# EAGLE design Programmer v1.0 (EAGLE 7.6.0)
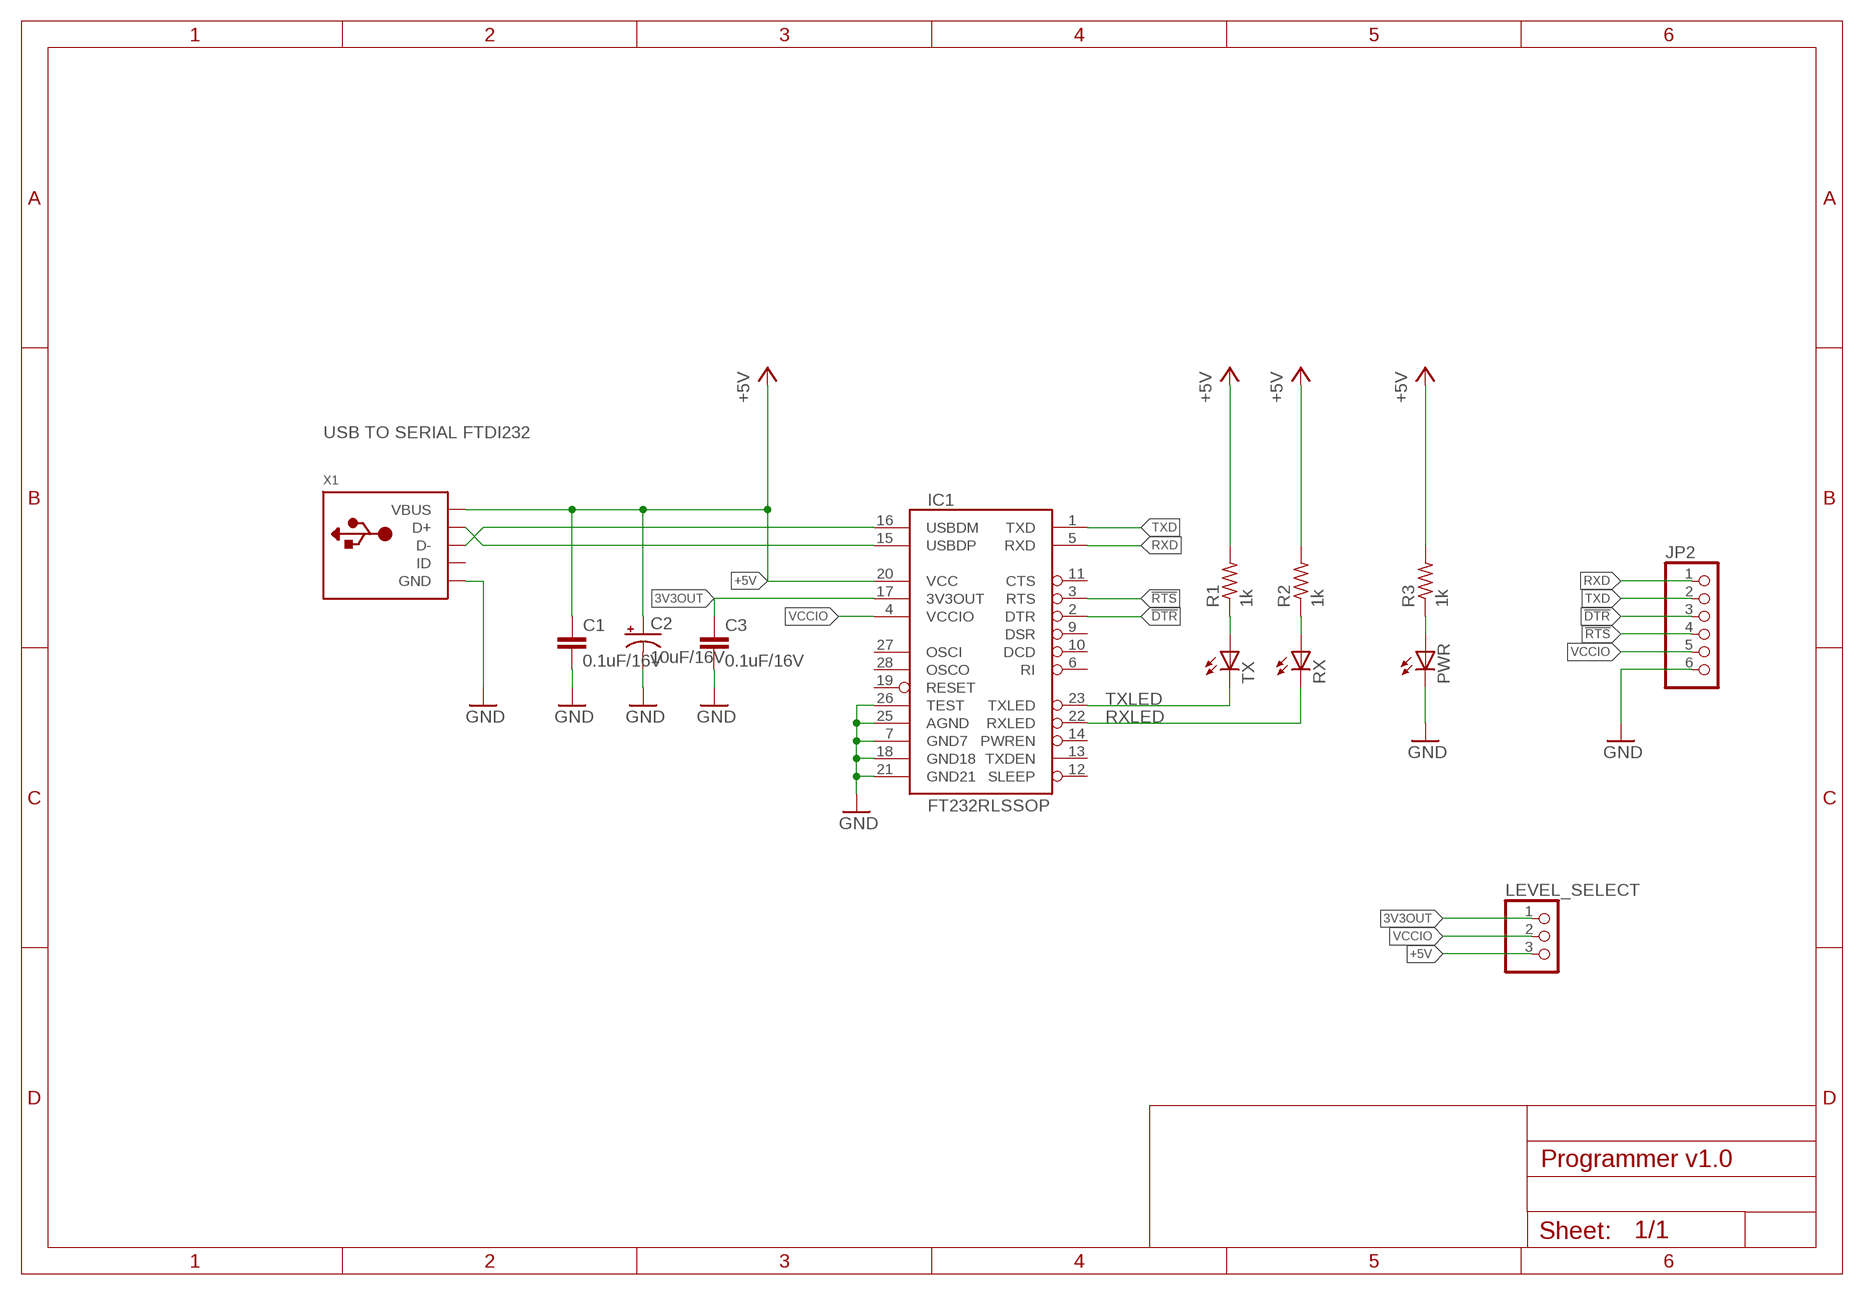
[diagram p0: schematic, sheet 1]

## Parts
C1  0.1uF/16V  C-EUC0805K  [C0805K]
C2  10uF/16V  SPARKFUN_CAP_POL1206  [SPARKFUN_EIA3216]
C3  0.1uF/16V  C-EUC0805K  [C0805K]
IC1  FT232RLSSOP  [SSOP28DB]
JP2  PINHD-1X6  [1X06]
LEVEL_SELECT  PINHD-1X3  [1X03]
PWR  LEDCHIP-LED0805  [CHIP-LED0805]
R1  1k  R-US_M0805  [M0805]
R2  1k  R-US_M0805  [M0805]
R3  1k  R-US_M0805  [M0805]
RX  LEDCHIP-LED0805  [CHIP-LED0805]
TX  LEDCHIP-LED0805  [CHIP-LED0805]
X1  USB_MICRO_20329_V2  [4UCONN_20329_V2]

## Nets
3V3OUT: C3.1 IC1.17(3V3OUT) LEVEL_SELECT.1
!DTR: IC1.2(DTR) JP2.3
!RTS: IC1.3(RTS) JP2.4
+5V: C1.1 C2.A(+) IC1.20(VCC) LEVEL_SELECT.3 R1.2 R2.2 R3.2 X1.VBUS
GND: C1.2 C2.C(-) C3.2 IC1.7(GND7) IC1.18(GND18) IC1.21(GND21) IC1.25(AGND) IC1.26(TEST) JP2.6 PWR.C X1.BASE@1(GND) X1.BASE@2(GND) X1.GND X1.SPRT@1(GND) X1.SPRT@2(GND) X1.SPRT@3(GND) X1.SPRT@4(GND)
N$1: PWR.A R3.1
N$9: R1.1 TX.A
N$11: R2.1 RX.A
RXD: IC1.5(RXD) JP2.1
RXLED: IC1.22(RXLED) RX.C
TXD: IC1.1(TXD) JP2.2
TXLED: IC1.23(TXLED) TX.C
USB_D+: IC1.15(USBDP) X1.D+
USB_D-: IC1.16(USBDM) X1.D-
VCCIO: IC1.4(VCCIO) JP2.5 LEVEL_SELECT.2
Unconnected: IC1.6(RI) IC1.9(DSR) IC1.10(DCD) IC1.11(CTS) IC1.12(SLEEP) IC1.13(TXDEN) IC1.14(PWREN) IC1.19(RESET) IC1.27(OSCI) IC1.28(OSCO) X1.ID

## Notes on the sheet
- USB TO SERIAL FTDI232

## Library data of the parts
C1 C3 = rcl:C-EU: CAPACITOR, European symbol
C2 = FTDI Basic-Sparkfun:SPARKFUN_CAP_POL: Capacitor Polarized These are standard SMD and PTH capacitors. Normally 10uF, 47uF, and 100uF in electrolytic and tantalum varieties. Always verify the external diameter of the through hole cap, it varies with capacity, voltage, and manufacturer. The EIA devices should be standard.
IC1 = FTDI Basic-v21-5V:FT232RL: USB UART FT232RL 4th Generation USB UART (USB <-> Serial) Controller. Spark Fun Electronics SKU : COM-00650
JP2 = pinhead:PINHD-1X6: PIN HEADER
LEVEL_SELECT = pinhead:PINHD-1X3: PIN HEADER
PWR RX TX = led:LED: LED OSRAM: - CHIPLED LG R971, LG N971, LY N971, LG Q971, LY Q971, LO R971, LY R971 LH N974, LH R974 LS Q976, LO Q976, LY Q976 LO Q996 - Hyper CHIPLED LW Q18S LB Q993, LB Q99A, LB R99A - SideLED LS A670, LO A670, LY A670, LG A670, LP A670 LB A673, LV A673, LT A673, LW A673 LH A674 LY A675 LS A676, LA A676, LO A676, LY A676, LW A676 LS A679, LY A679, LG A679 - Hyper Micro SIDELED® LS Y876, LA Y876, LO Y876, LY Y876 LT Y87S - SmartLED LW L88C, LW L88S LB L89C, LB L89S, LG L890 LS L89K, LO L89K, LY L89K LS L896, LA L896, LO L896, LY L896 - TOPLED LS T670, LO T670, LY T670, LG T670, LP T670 LSG T670, LSP T670, LSY T670, LOP T670, LYG T670 LG T671, LOG T671, LSG T671 LB T673, LV T673, LT T673, LW T673 LH T674 LS T676, LA T676, LO T676, LY T676, LB T676, LH T676, LSB T676, LW T676 LB T67C, LV T67C, LT T67C, LS T67K, LO T67K, LY T67K, LW E67C LS E67B, LA E67B, LO E67B, LY E67B, LB E67C, LV E67C, LT E67C LW T67C LS T679, LY T679, LG T679 LS T770, LO T770, LY T770, LG T770, LP T770 LB T773, LV T773, LT T773, LW T773 LH T774 LS E675, LA E675, LY E675, LS T675 LS T776, LA T776, LO T776, LY T776, LB T776 LHGB T686 LT T68C, LB T68C - Hyper Mini TOPLED® LB M676 - Mini TOPLED Santana® LG M470 LS M47K, LO M47K, LY M47K Source: http://www.osram.convergy.de LUXEON: - LUMILED® LXK2-PW12-R00, LXK2-PW12-S00, LXK2-PW14-U00, LXK2-PW14-V00 LXK2-PM12-R00, LXK2-PM12-S00, LXK2-PM14-U00 LXK2-PE12-Q00, LXK2-PE12-R00, LXK2-PE12-S00, LXK2-PE14-T00, LXK2-PE14-U00 LXK2-PB12-K00, LXK2-PB12-L00, LXK2-PB12-M00, LXK2-PB14-N00, LXK2-PB14-P00, LXK2-PB14-Q00 LXK2-PR12-L00, LXK2-PR12-M00, LXK2-PR14-Q00, LXK2-PR14-R00 LXK2-PD12-Q00, LXK2-PD12-R00, LXK2-PD12-S00 LXK2-PH12-R00, LXK2-PH12-S00 LXK2-PL12-P00, LXK2-PL12-Q00, LXK2-PL12-R00 Source: www.luxeon.com KINGBRIGHT: KA-3528ASYC Source: www.kingbright.com
R1-R3 = rcl:R-US_: RESISTOR, American symbol
X1 = Adafruit SIM808 Breakout:USB: USB Connectors USBMINIB - Surface Mount Female Mini-B USB Connector 4UConnector: 06564

## Net classes
0 default: width 0.203 mm, drill 0.356 mm, clearance 0.203 mm

## Board
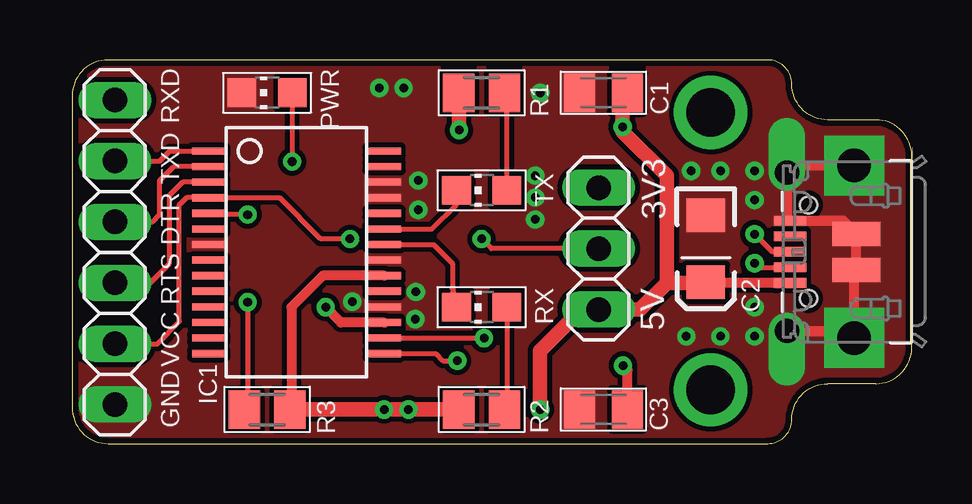
[diagram p1: board, top side]
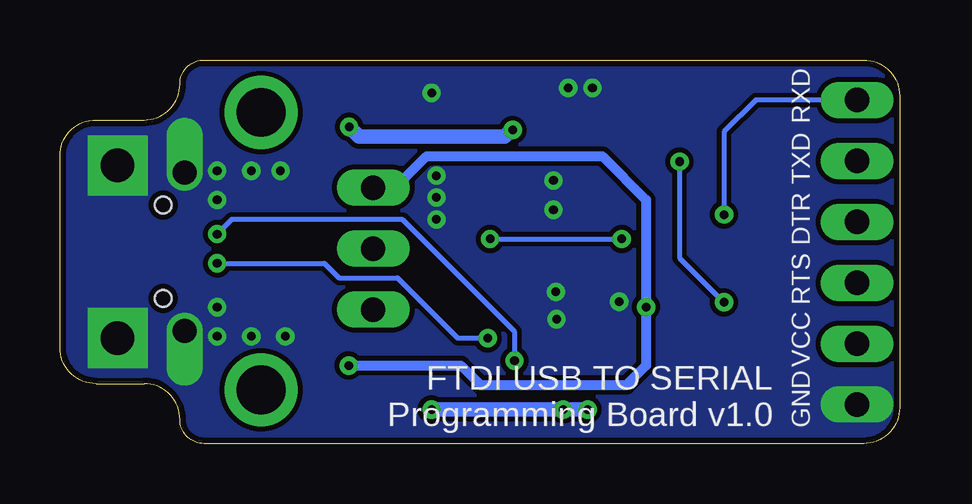
[diagram p2: board, bottom side, seen from below]

Size 35 x 16 mm. Coordinates in mm from the lower left corner, seen from the top.
Outline: 1.5,0 29,0 arc90 30,1 arc-90 31.5,2.5 33.5,2.5 arc90 35,4 35,12 arc90 33.5,13.5 31.5,13.5 arc-90 30,15 arc90 29,16 1.5,16 arc90 0,14.5 0,1.5 arc90 1.5,0
Copper layers (1*16): Top 0.035mm / dielectric 1.5mm / Bottom 0.035mm
Design rules "default *": minimum track width 8mil, minimum drill 14mil, track to track 8mil, track to pad 8mil, pad to pad 8mil, via to via 8mil, smd to smd 8mil, copper to edge 10mil, drill to drill 8mil, minimum pad ring 10mil, minimum via ring 8mil, stop-mask expansion 4mil, vias tented up to drill 14mil, thermal gap 10mil

### Footprints (pad centres in the part's own frame; a part is rotated, then mirrored left to right if it is on the bottom)
C0805K = smd 1.3 x 1.6: 1 -1,0; 2 1,0
SPARKFUN_EIA3216 = smd 1.4 x 1.6: A 1.4,0; C -1.4,0
SSOP28DB = smd 0.3 x 1.397: 1 -4.225,-3.656; 2 -3.575,-3.656; 3 -2.925,-3.656; 4 -2.275,-3.656; 5 -1.625,-3.656; 6 -0.975,-3.656; 7 -0.325,-3.656; 8 0.325,-3.656; 9 0.975,-3.656; 10 1.625,-3.656; 11 2.275,-3.656; 12 2.925,-3.656; 13 3.575,-3.656; 14 4.225,-3.656; 15 4.225,3.656; 16 3.575,3.656; 17 2.925,3.656; 18 2.275,3.656; 19 1.625,3.656; 20 0.975,3.656; 21 0.325,3.656; 22 -0.325,3.656; 23 -0.975,3.656; 24 -1.625,3.656; 25 -2.275,3.656; 26 -2.925,3.656; 27 -3.575,3.656; 28 -4.225,3.656
1X06 = drill 1.016 long: 1 -6.35,0; 2 -3.81,0; 3 -1.27,0; 4 1.27,0; 5 3.81,0; 6 6.35,0
1X03 = drill 1.016 long: 1 -2.54,0; 2 0,0; 3 2.54,0
CHIP-LED0805 = smd 1.2 x 1.2: A 0,-1.05; C 0,1.05
M0805 = smd 1.3 x 1.6: 1 -0.95,0; 2 0.95,0
4UCONN_20329_V2 = smd 1 x 2: BASE@1 -0.75,-2; BASE@2 0.75,-2 | smd 0.4 x 1.35: D+ 0,0.775; D- -0.65,0.775; GND 1.3,0.775; ID 0.65,0.775; VBUS -1.3,0.775 | drill 1.016 pad 1.454 offset: SPRT@1 -3.3,0.9; SPRT@2 3.3,0.9 | drill 1.397 pad 2.5 square: SPRT@3 -3.6,-1.9; SPRT@4 3.6,-1.9 | hole 0.7: -1.95,0; 1.95,0

### Placement (x,y rotation side)
C1  22.15,14.63 180 top
C2  26.42,8.13 270 top
C3  22.15,1.42 180 top
IC1  9.35,7.98 270 top
JP2  1.78,7.98 270 top
LEVEL_SELECT  21.95,8.13 270 top
PWR  8.13,14.63 90 top
R1  17.07,14.63 180 top
R2  17.07,1.42 180 top
R3  8.13,1.42 0 top
RX  17.07,5.69 90 top
TX  17.07,10.57 90 top
X1  30.7,8 90 top

### Tracks (layer width: path | path; a pad name or v marks a point on that pad's centre or on a via)
3V3OUT  (via drill 0.36 pad 0.76)
  Top 0.406: IC1.17 11.21,5.05 v10.57,5.69 | C3.1 23.15,3.06 v22.96,3.25
  Bottom 0.406: LEVEL_SELECT.1 21.03,10.67 19.71,11.99 12.39,11.99 10.57,10.16 v10.57,5.69 10.57,3.25 11.38,2.44 17.48,2.44 18.29,3.25 v22.96,3.25
!DTR
  Top 0.203: JP2.3 3.35,9.25 3.66,9.55 3.66,10.97 4.24,11.55 IC1.2
!RTS
  Top 0.203: JP2.4 3.25,6.71 4.06,7.52 4.06,10.36 4.6,10.9 IC1.3
+5V  (via drill 0.36 pad 0.76)
  Top 0.406: X1.VBUS 26.44,6.7 C2.A 26.39,6.71 | IC1.20 10.46,7 9.14,5.69 9.14,1.49 R3.2
  Top 0.61: 24.79,6.71 23.67,5.59 LEVEL_SELECT.3 21.23,5.59 19.51,3.86 v19.51,1.42 | 24.79,6.71 26.39,6.71 | 24.79,6.71 24.79,11.18 22.95,13.02 v22.95,13.21 22.95,14.43 C1.1 | R3.2 v13.01,1.42 v14.02,1.42 R2.2 | R1.2 16.12,13.09 v16.13,13.08
  Bottom 0.61: v16.13,13.08 16.18,13.08 16.46,12.8 22.54,12.8 v22.95,13.21 | v19.51,1.42 v13.01,1.42
GND  (via drill 0.36 pad 0.76)
  Top 0.406: X1.SPRT@1 32.3,4.7 X1.SPRT@3 32.6,7.15 X1.BASE@1 X1.BASE@2 32.15,9.3 X1.GND 29.8,9.43 X1.SPRT@2 30.1,11.6 X1.SPRT@4
  other vias: 27.03,11.38 28.45,11.38 19.51,14.63 12.8,14.83 13.82,14.83 28.45,4.47 27.03,4.47 25.6,4.47 25.81,11.38 14.3,5.18 11.68,5.92 14.43,10.97 14.33,6.32 14.43,9.75 19.3,11.18 19.3,9.35 19.3,10.26 28.45,10.16 28.45,5.69
  pour Top (no thermals): -0.2,16.26 35.36,16.26 35.36,-0.2 -0.2,-0.2
  pour Bottom (no thermals): -0.2,16.26 35.36,16.26 35.36,-0.2 -0.2,-0.2
N$1  (via drill 0.36 pad 0.76)
  Top 0.203: PWR.A v9.18,11.77 v9.17,11.76 | v7.32,5.89 7.32,1.56 R3.1
  Bottom 0.203: v9.17,11.76 9.17,7.75 v7.32,5.89
N$3  (via drill 2.03 pad 0.41)
  other vias: 26.62,2.24
N$4  (via drill 2.03 pad 0.41)
  other vias: 26.62,13.81
N$9
  Top 0.203: TX.A 18.12,14.53 R1.1
N$11
  Top 0.203: RX.A 18.12,1.52 R2.1
RXD  (via drill 0.36 pad 0.76)
  Top 0.203: v7.32,9.55 5.74,9.55 IC1.5
  Bottom 0.203: JP2.1 5.99,14.33 7.32,13.01 v7.32,9.55
RXLED
  Top 0.203: 15.85,6.3 RX.C 15.85,6.47 15.85,7.52 15.07,8.3 IC1.22
TXD
  Top 0.203: JP2.2 3.66,11.79 4.06,12.19 IC1.1
TXLED
  Top 0.203: IC1.23 15.01,8.95 16.02,9.96 TX.C
USB_D+  (via drill 0.36 pad 0.76)
  Top 0.203: X1.D+ 29.19,8 v28.45,8.74 | IC1.15 15.15,3.75 15.44,3.45 v16.05,3.45
  Bottom 0.203: v28.45,8.74 27.84,9.35 20.73,9.35 16.05,4.67 v16.05,3.45
USB_D-  (via drill 0.36 pad 0.76)
  Top 0.203: X1.D- 29.89,7.32 28.65,7.32 v28.45,7.52 | IC1.16 v17.16,4.4 v17.17,4.39
  Bottom 0.203: v28.45,7.52 23.98,7.52 23.37,6.91 20.93,6.91 18.41,4.39 v17.17,4.39
VCCIO  (via drill 0.36 pad 0.76)
  Top 0.203: JP2.5 3.56,4.17 4.47,5.08 4.47,9.96 4.76,10.25 IC1.4 8.65,10.25 10.36,8.53 v11.58,8.53 | LEVEL_SELECT.2 17.48,8.13 v17.07,8.53
  Bottom 0.203: v17.07,8.53 v11.58,8.53

### Text on the board
tNames: RXD | TXD | 3V3 | DTR | RTS | 5V | VCC | GND
bNames: RXD | TXD | DTR | RTS | VCC | FTDI USB TO SERIAL / Programming Board v1.0 | GND
bStop: 16/11/'17